# Altium project Gagabiro.PrjPcb
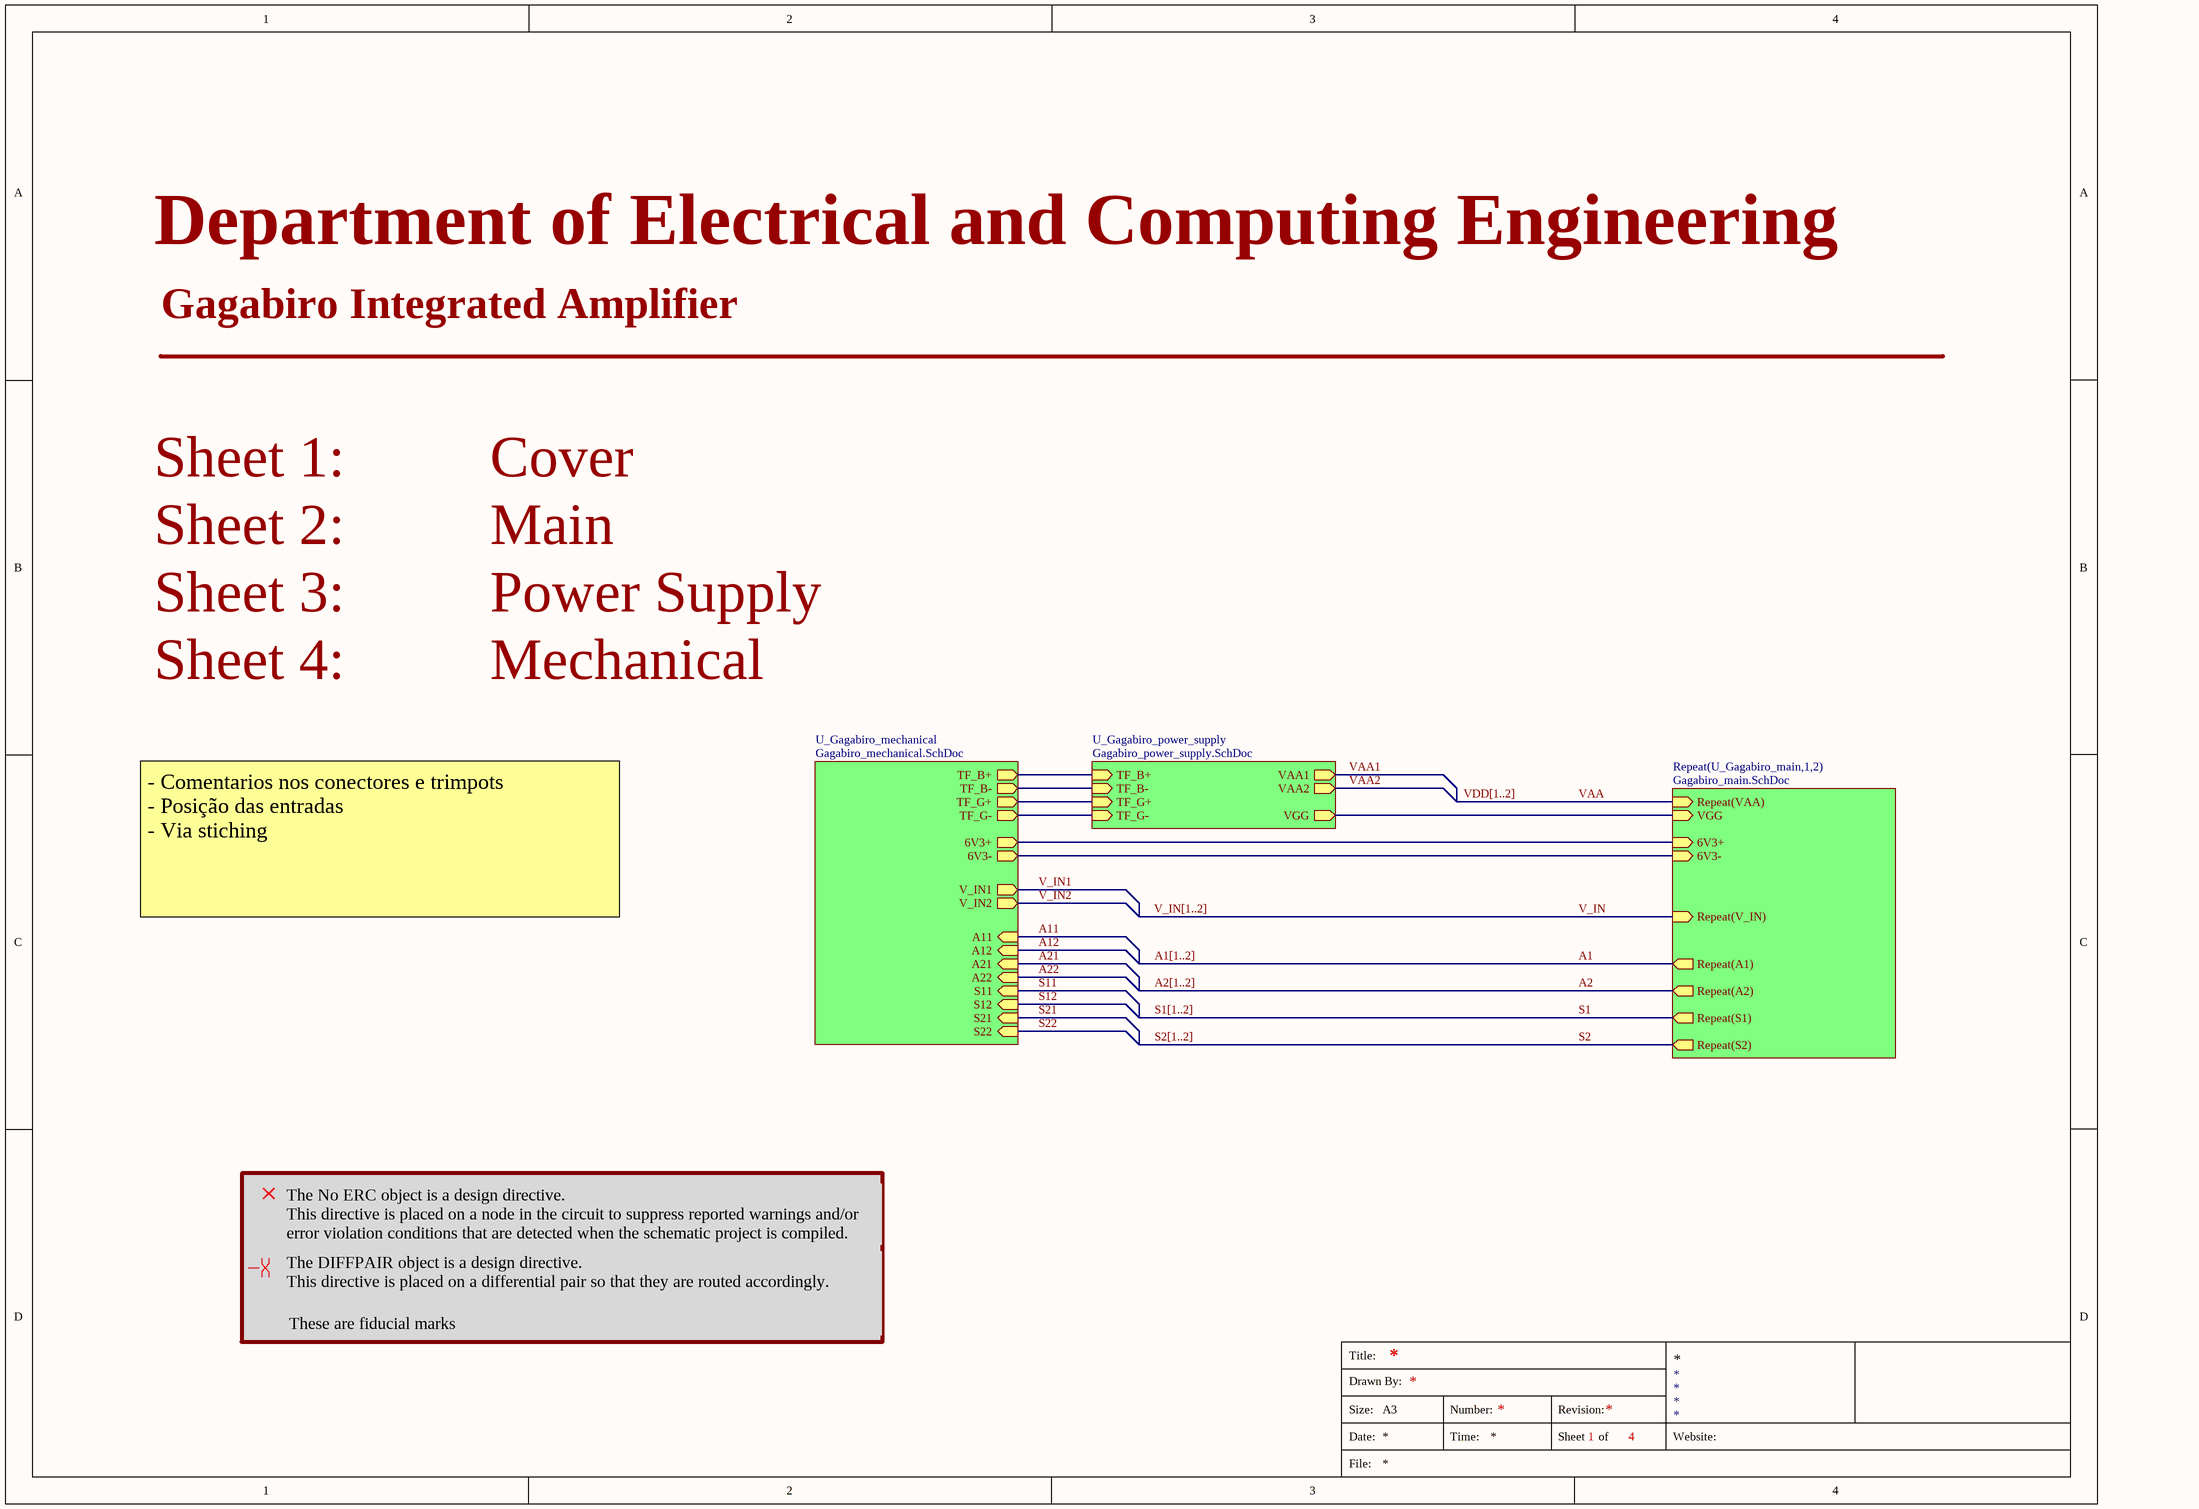
[diagram p0: Gagabiro_cover_letter.SchDoc]
4 sheets, 171 parts. Net scope: hierarchical (ports join the sheet entries above them; power ports are global).
Board file: Gagabiro.PcbDoc
Sheets:
  Gagabiro_cover_letter.SchDoc
    U_Gagabiro_main1 = Gagabiro_main.SchDoc
    U_Gagabiro_main2 = Gagabiro_main.SchDoc
    U_Gagabiro_mechanical = Gagabiro_mechanical.SchDoc
    U_Gagabiro_power_supply = Gagabiro_power_supply.SchDoc

## Sheet Gagabiro_cover_letter.SchDoc
size 393 x 281 mm; SheetNumber: 1; SheetTotal: 4

### Sub-sheets
Repeat(U_Gagabiro_main,1,2) = Gagabiro_main.SchDoc: Repeat(VAA) (in), Repeat(V_IN) (in), 6V3+ (in), 6V3- (in), VGG (in), Repeat(A1) (out), Repeat(S1) (out), Repeat(A2) (out), Repeat(S2) (out)
U_Gagabiro_mechanical = Gagabiro_mechanical.SchDoc: 6V3+ (out), 6V3- (out), V_IN1 (out), V_IN2 (out), TF_B+ (out), TF_B- (out), A11 (in), S11 (in), A21 (in), S21 (in), A12 (in), S12 (in), A22 (in), S22 (in), TF_G+ (out), TF_G- (out)
U_Gagabiro_power_supply = Gagabiro_power_supply.SchDoc: TF_B+ (in), TF_B- (in), VAA1 (out), VAA2 (out), VGG (out), TF_G+ (in), TF_G- (in)

### Nets
VAA1: sheet U_Gagabiro_power_supply/VAA1, sheet U_Gagabiro_power_supply/VAA2  [also labelled VAA2]
VGG: sheet Repeat(U_Gagabiro_main,1,2)/VGG, sheet U_Gagabiro_power_supply/VGG
6V3+: sheet Repeat(U_Gagabiro_main,1,2)/6V3+, sheet U_Gagabiro_mechanical/6V3+
6V3-: sheet Repeat(U_Gagabiro_main,1,2)/6V3-, sheet U_Gagabiro_mechanical/6V3-
A1: sheet Repeat(U_Gagabiro_main,1,2)/Repeat(A1)
A2: sheet Repeat(U_Gagabiro_main,1,2)/Repeat(A2)
S1: sheet Repeat(U_Gagabiro_main,1,2)/Repeat(S1)
S2: sheet Repeat(U_Gagabiro_main,1,2)/Repeat(S2)
TF_B+: sheet U_Gagabiro_mechanical/TF_B+, sheet U_Gagabiro_power_supply/TF_B+
TF_B-: sheet U_Gagabiro_mechanical/TF_B-, sheet U_Gagabiro_power_supply/TF_B-
TF_G+: sheet U_Gagabiro_mechanical/TF_G+, sheet U_Gagabiro_power_supply/TF_G+
TF_G-: sheet U_Gagabiro_mechanical/TF_G-, sheet U_Gagabiro_power_supply/TF_G-
V_IN: sheet Repeat(U_Gagabiro_main,1,2)/Repeat(V_IN)
VAA: sheet Repeat(U_Gagabiro_main,1,2)/Repeat(VAA)

### Buses and harness runs
bus A1[1..2]
bus A2[1..2]
bus S1[1..2]
bus S2[1..2]
bus V_IN[1..2]
bus VDD[1..2]

### Layout directives
differential pair: (no net found under the mark)

### Notes on the sheet
- Department of Electrical and Computing Engineering
- Gagabiro Integrated Amplifier
- Sheet 1:          Cover
- Sheet 2:          Main
- Sheet 3:          Power Supply
- Sheet 4:          Mechanical
- - Comentarios nos conectores e trimpots
  - Posição das entradas
  - Via stiching
- The No ERC object is a design directive.
  This directive is placed on a node in the circuit to suppress reported warnings and/or error violation conditions that are detected when the schematic project is compiled.
- The DIFFPAIR object is a design directive.
  This directive is placed on a differential pair so that they are routed accordingly.
- These are fiducial marks
- Title:
- Drawn By:
- Size:
- Date:
- File:
- A3
- Number:
- Time:
- Revision:
- Sheet
- of
- Website:

## Sheet Gagabiro_main.SchDoc
size 393 x 281 mm; SheetNumber: 2; SheetTotal: 4
Used 2 times, as channels U_Gagabiro_main1, U_Gagabiro_main2. Parts and nets are listed once, with the designators drawn on the sheet.
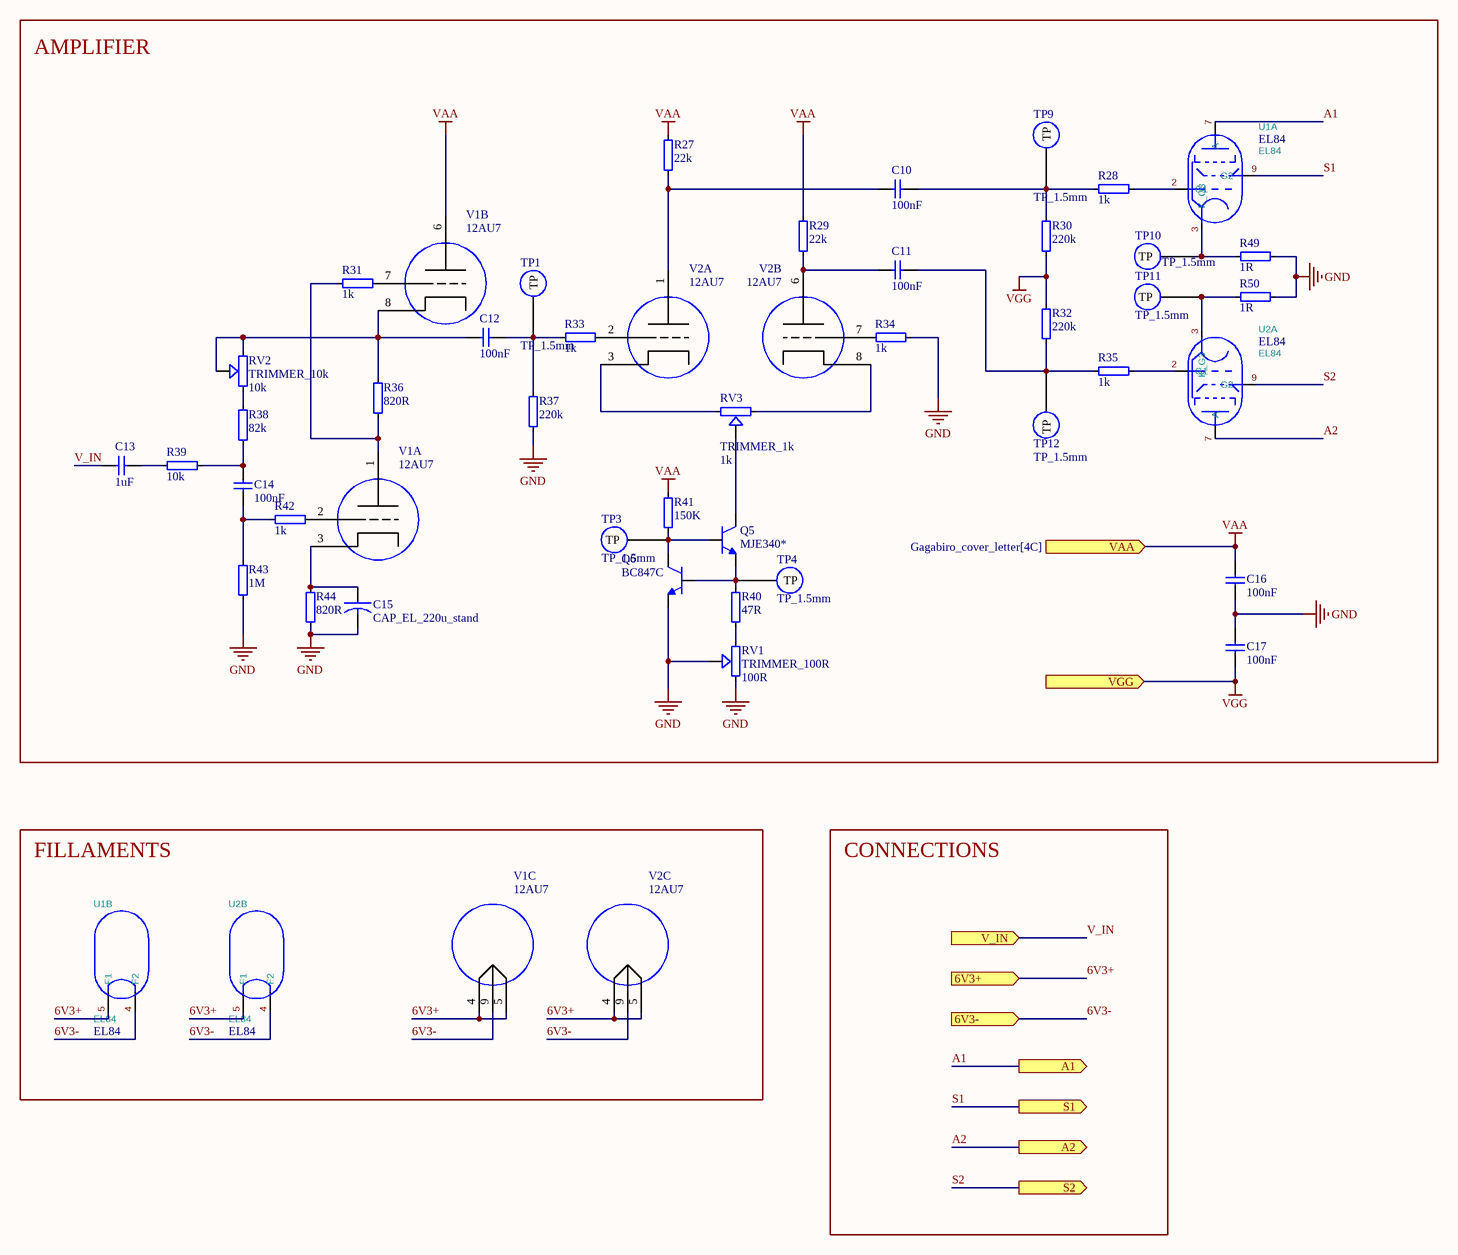
[diagram p1: Gagabiro_main.SchDoc]

### Parts
C10  100nF  [CAP_panassonic_100n_450V]
C11  100nF  [CAP_panassonic_100n_450V]
C12  100nF  [CAP_panassonic_100n_450V]
C13  1uF  [CAP_panassonic_1u_450V]
C14  100nF  [CAP_panassonic_100n_450V]
C15  CAP_EL_220u_stand  [CAPPRD500W50D630H1120_stand]
C16  100nF  [CAP_panassonic_100n_450V]
C17  100nF  [CAP_panassonic_100n_450V]
Q5  MJE340*  [TO126]
Q6  BC847C  [TRANS_BC847C]
R27  22k  [RES_2W_vertical]
R28  1k  [RES_2W_vertical]
R29  22k  [RES_2W_vertical]
R30  220k  [RES_2W_vertical]
R31  1k  [RES_2W_vertical]
R32  220k  [RES_2W_vertical]
R33  1k  [RES_2W_vertical]
R34  1k  [RES_2W_vertical]
R35  1k  [RES_2W_vertical]
R36  820R  [RES_2W_vertical]
R37  220k  [RES_2W_vertical]
R38  82k  [RES_2W_vertical]
R39  10k  [RES_2W_vertical]
R40  47R  [RES_2W_vertical]
R41  150K  [RES_2W_vertical]
R42  1k  [RES_2W_vertical]
R43  1M  [RES_2W_vertical]
R44  820R  [RES_2W_vertical]
R49  1R  [RES_2W_vertical]
R50  1R  [RES_2W_vertical]
RV1  TRIMMER_100R  value 100R  [TRIM_PV36W204C01B00 - duplicate]
RV2  TRIMMER_10k  value 10k  [TRIM_PV36W204C01B00 - duplicate]
RV3  TRIMMER_1k  value 1k  [TRIM_PV36W204C01B00 - duplicate]
TP1  TP_1.5mm  [test_point_1.5mm]
TP3  TP_1.5mm  [test_point_1.5mm]
TP4  TP_1.5mm  [test_point_1.5mm]
TP9  TP_1.5mm  [test_point_1.5mm]
TP10  TP_1.5mm  [test_point_1.5mm]
TP11  TP_1.5mm  [test_point_1.5mm]
TP12  TP_1.5mm  [test_point_1.5mm]
U1  EL84  [EL84]  (parts A,B of 2)
U2  EL84  [EL84]  (parts A,B of 2)
V1  12AU7  [12A_7]  (parts A,B,C of 3)
V2  12AU7  [12A_7]  (parts A,B,C of 3)

### Blocks framed on the sheet
AMPLIFIER: C10-C17 Q5 Q6 R27-R44 R49 R50 RV1-RV3 TP1 TP3 TP4 TP9-TP12 U1 U2 V1 V2
FILLAMENTS: U1 U2 V1 V2

### Ports
6V3+ (in, see Gagabiro_cover_letter[4C], Gagabiro_mechanical[2B]), 6V3- (in, see Gagabiro_cover_letter[4C], Gagabiro_mechanical[2B]), A1 (out, see Gagabiro_cover_letter[4C]), A2 (out, see Gagabiro_cover_letter[4C]), S1 (out, see Gagabiro_cover_letter[4C]), S2 (out, see Gagabiro_cover_letter[4C]), V_IN (in, see Gagabiro_cover_letter[4C]), VAA (in, see Gagabiro_cover_letter[4C]), VGG (in, see Gagabiro_cover_letter[4C], Gagabiro_power_supply[2D])

### Nets
GND: C15.N C16.1 C17.1 Q6.2(E) R34.2 R37.1 R43.1 R44.1 R49.2 R50.2 RV1.1 RV1.2
VAA: C16.2 R27.2 R29.2 R41.2 V1.6 ; port VAA
VGG: C17.2 R30.1 R32.1 ; port VGG
6V3+: U1.5(F1) U2.5(F1) V1.4 V1.5 V2.4 V2.5 ; port 6V3+
6V3-: U1.4(F2) U2.4(F2) V1.9 V2.9 ; port 6V3-
A1: U1.7(A) ; port A1
A2: U2.7(A) ; port A2
S1: U1.9(G2) ; port S1
S2: U2.9(G2) ; port S2
V_IN: C13.1 ; port V_IN
NetC10_1: C10.1 R27.1 V2.1
NetC10_2: C10.2 R28.1 R30.2 TP9.1(TP)
NetC11_1: C11.1 R29.1 V2.6
NetC11_2: C11.2 R32.2 R35.1 TP12.1(TP)
NetC12_1: C12.1 R36.2 RV2.2 RV2.3 V1.8
NetC12_2: C12.2 R33.1 R37.2 TP1.1(TP)
NetC13_2: C13.2 R39.1
NetC14_1: C14.1 R42.1 R43.2
NetC14_2: C14.2 R38.1 R39.2
NetC15_P: C15.P R44.2 V1.3
NetQ5_1: Q5.1(E) Q6.1(B) R40.2 TP4.1(TP)
NetQ5_2: Q5.2(C) RV3.2
NetQ5_3: Q5.3(B) Q6.3(C) R41.1 TP3.1(TP)
NetR28_2: R28.2 U1.2(G1)
NetR31_1: R31.1 R36.1 V1.1
NetR31_2: R31.2 V1.7
NetR33_2: R33.2 V2.2
NetR34_1: R34.1 V2.7
NetR35_2: R35.2 U2.2(G1)
NetR38_2: R38.2 RV2.1
NetR40_1: R40.1 RV1.3
NetR42_2: R42.2 V1.2
NetR49_1: R49.1 TP10.1(TP) U1.3(K_G3)
NetR50_1: R50.1 TP11.1(TP) U2.3(K_G3)
NetRV3_1: RV3.1 V2.8
NetRV3_3: RV3.3 V2.3

### Channels
U_Gagabiro_main1: designators end in A; ports 6V3+=6V3+ 6V3-=6V3- A1=A1 A2=A2 S1=S1 S2=S2 V_IN=V_IN VAA=VAA1 VGG=VGG
U_Gagabiro_main2: designators end in B; ports 6V3+=6V3+ 6V3-=6V3- A1=A1 A2=A2 S1=S1 S2=S2 V_IN=V_IN VAA=VAA1 VGG=VGG

### Notes on the sheet
- CONNECTIONS
- Title:
- Drawn By:
- Size:
- Date:
- File:
- A3
- Number:
- Time:
- Revision:
- Sheet
- of
- Website:

### Library data of the parts
C10-C12 C14 C16 C17 = CAP_POLY_100n: Capacitor, Silver Mica; Part Number: CMICA_47PF; Value: 100nF
C13 = CAP_POLY_1u: Capacitor, Silver Mica; Part Number: CMICA_47PF; Value: 1uF
C15 = CAP_EL_220u_stand: 220F 16V Aluminum Electrolytic Capacitors Radial, Can 1000 Hrs @ 105C; MP: EEU-HD1C221B; Value: 220uF; MF: Panasonic; Availability: In Stock; Purchase-URL: https://pricing.snapeda.com/search/part/EEU-HD1C221B/?ref=eda; Package: RADIAL-2 Panasonic; Check_prices: https://www.snapeda.com/parts/EEU-HD1C221B/Panasonic/view-part/?ref=eda; SnapEDA_Link: https://www.snapeda.com/parts/EEU-HD1C221B/Panasonic/view-part/?ref=snap; Price: None
Q5 = MJE340*: Bipolar (BJT) Transistor NPN 300 V 500 mA - 20.8 W Through Hole SOT-32-3; MF: STMicroelectronics; MP: MJE340; SnapEDA_Link: https://www.snapeda.com/parts/MJE340/STMicroelectronics/view-part/?ref=snap; Package: TO-126-3 Motorola; Value: *; Check_prices: https://www.snapeda.com/parts/MJE340/STMicroelectronics/view-part/?ref=eda
Q6 = BC847C: Bipolar (BJT) Transistor NPN 45 V 100 mA 300MHz 250 mW Surface Mount SOT-23-3 (TO-236); MF: Diotec Semiconductor; Price: None; SnapEDA_Link: https://www.snapeda.com/parts/BC847C/Diotec/view-part/?ref=snap; Purchase-URL: https://pricing.snapeda.com/search/part/BC847C/?ref=eda; Availability: In Stock; MP: BC847C; Package: SOT-23-3 Diotec; Check_prices: https://www.snapeda.com/parts/BC847C/Diotec/view-part/?ref=eda; Value: *
R27 R29 = R_2W_vertical_22k: Resistor, 2W; Part Number: R2W; ComponentLink1URL: N.A.; ComponentLink1Description: Datasheet; ComponentLink2URL: N.A.; ComponentLink2Description: Supplier link; Author: colombari; Value: 22k
R28 R31 R33-R35 R42 = R_2W_vertical_1k: Resistor, 2W; Part Number: R2W; ComponentLink1URL: N.A.; ComponentLink1Description: Datasheet; ComponentLink2URL: N.A.; ComponentLink2Description: Supplier link; Author: colombari; Value: 1k
R30 R32 R37 = R_2W_vertical_220k: Resistor, 2W; Part Number: R2W; ComponentLink1URL: N.A.; ComponentLink1Description: Datasheet; ComponentLink2URL: N.A.; ComponentLink2Description: Supplier link; Author: colombari; Value: 220k
R36 R44 = R_2W_vertical_820R: Resistor, 2W; Part Number: R2W; ComponentLink1URL: N.A.; ComponentLink1Description: Datasheet; ComponentLink2URL: N.A.; ComponentLink2Description: Supplier link; Author: colombari; Value: 820R
R38 = R_2W_vertical_82k: Resistor, 2W; Part Number: R2W; ComponentLink1URL: N.A.; ComponentLink1Description: Datasheet; ComponentLink2URL: N.A.; ComponentLink2Description: Supplier link; Author: colombari; Value: 82k
R39 = R_2W_vertical_10k: Resistor, 2W; Part Number: R2W; ComponentLink1URL: N.A.; ComponentLink1Description: Datasheet; ComponentLink2URL: N.A.; ComponentLink2Description: Supplier link; Author: colombari; Value: 10k
R40 = R_2W_vertical_47R: Resistor, 2W; Part Number: R2W; ComponentLink1URL: N.A.; ComponentLink1Description: Datasheet; ComponentLink2URL: N.A.; ComponentLink2Description: Supplier link; Author: colombari; Value: 47R
R41 = R_2W_vertical_150K: Resistor, 2W; Part Number: R2W; ComponentLink1URL: N.A.; ComponentLink1Description: Datasheet; ComponentLink2URL: N.A.; ComponentLink2Description: Supplier link; Author: colombari; Value: 150K
R43 = R_2W_vertical_1M: Resistor, 2W; Part Number: R2W; ComponentLink1URL: N.A.; ComponentLink1Description: Datasheet; ComponentLink2URL: N.A.; ComponentLink2Description: Supplier link; Author: colombari; Value: 1M
R49 R50 = R_2W_vertical_1R: Resistor, 2W; Part Number: R2W; ComponentLink1URL: N.A.; ComponentLink1Description: Datasheet; ComponentLink2URL: N.A.; ComponentLink2Description: Supplier link; Author: colombari; Value: 1R
RV1 = TRIMMER_100R: TRIMMER; MF: Bourns Electronics; MP: PV36W204C01B00.; SnapEDA_Link: https://www.snapeda.com/parts/PV36W204C01B00./Bourns/view-part/?ref=snap; Package: None; Check_prices: https://www.snapeda.com/parts/PV36W204C01B00./Bourns/view-part/?ref=eda
RV2 = TRIMMER_10k: TRIMMER; MF: Bourns Electronics; MP: PV36W204C01B00.; SnapEDA_Link: https://www.snapeda.com/parts/PV36W204C01B00./Bourns/view-part/?ref=snap; Package: None; Check_prices: https://www.snapeda.com/parts/PV36W204C01B00./Bourns/view-part/?ref=eda
RV3 = TRIMMER_1k: TRIMMER; MF: Bourns Electronics; MP: PV36W204C01B00.; SnapEDA_Link: https://www.snapeda.com/parts/PV36W204C01B00./Bourns/view-part/?ref=snap; Package: None; Check_prices: https://www.snapeda.com/parts/PV36W204C01B00./Bourns/view-part/?ref=eda
V1 V2 = 12AU7: TUNGSOL 12AU7 NEW PRD PREAMP TB; MF: RCA; MP: 12AX7; SnapEDA_Link: https://www.snapeda.com/parts/12AX7/RCA/view-part/?ref=snap; Package: None; Check_prices: https://www.snapeda.com/parts/12AX7/RCA/view-part/?ref=eda; Value: *
U1 U2 = EL84: Footprint: Valve:Valve_Noval_P; Value: EL84

## Sheet Gagabiro_mechanical.SchDoc
size 393 x 281 mm; SheetNumber: 4; SheetTotal: 4
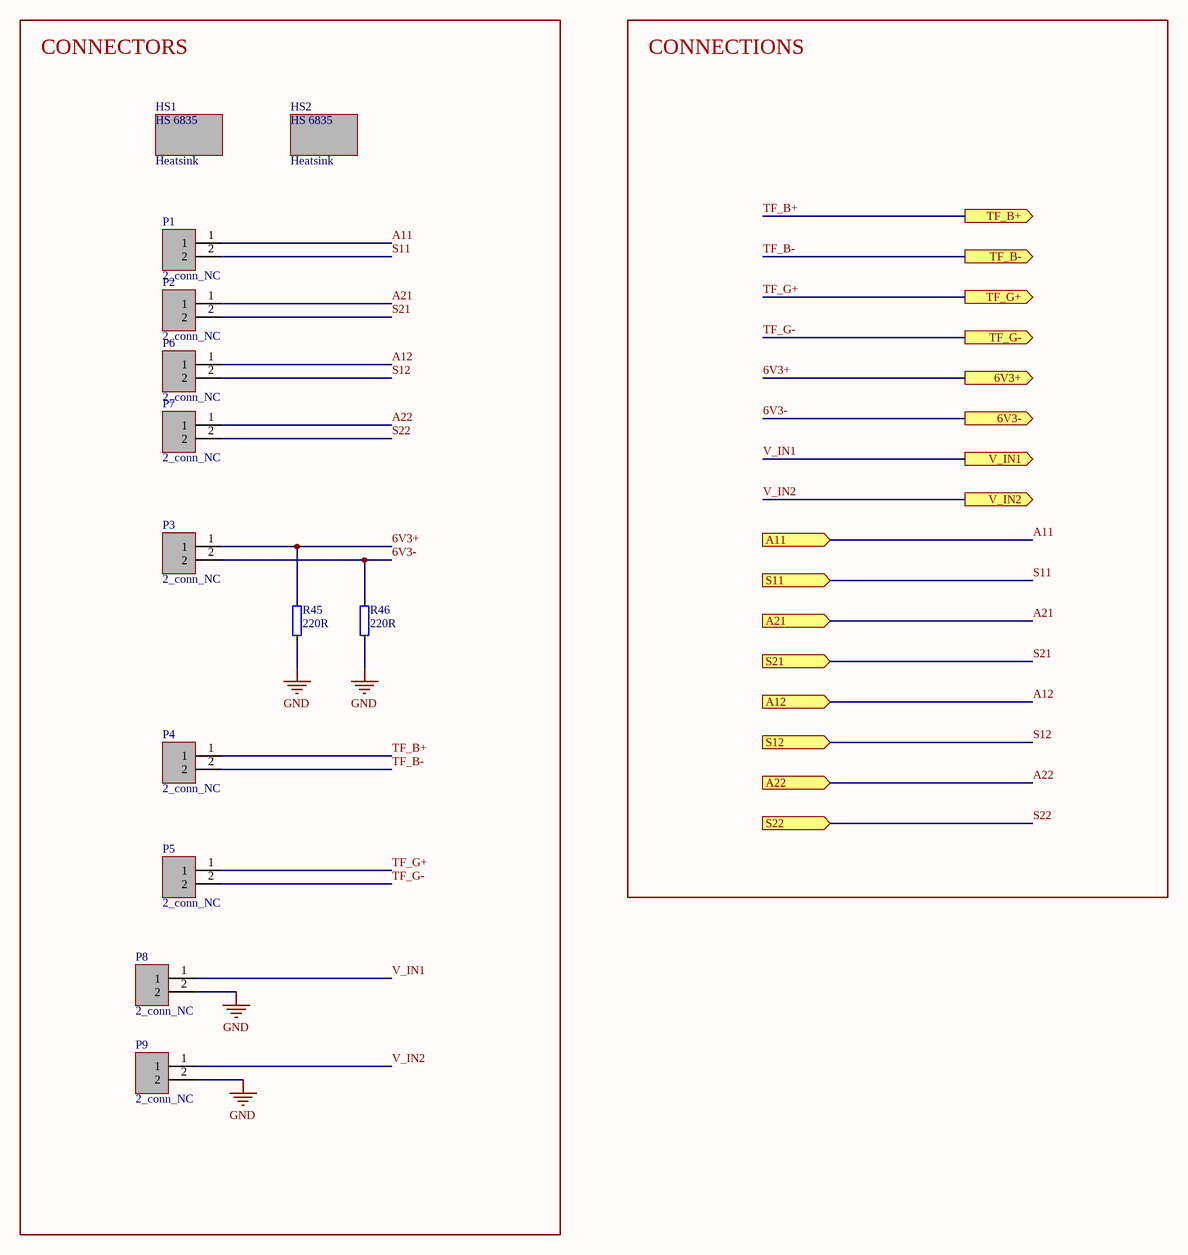
[diagram p2: Gagabiro_mechanical.SchDoc]

### Parts
HS1  Heatsink  [heatsink_HS_6835]
HS2  Heatsink  [heatsink_HS_6835]
P1  2_conn_NC  [2_conn_NC]
P2  2_conn_NC  [2_conn_NC]
P3  2_conn_NC  [2_conn_NC]
P4  2_conn_NC  [2_conn_NC]
P5  2_conn_NC  [2_conn_NC]
P6  2_conn_NC  [2_conn_NC]
P7  2_conn_NC  [2_conn_NC]
P8  2_conn_NC  [2_conn_NC]
P9  2_conn_NC  [2_conn_NC]
R45  220R  [RES_2W_vertical]
R46  220R  [RES_2W_vertical]

### Blocks framed on the sheet
CONNECTORS: HS1 HS2 P1-P9 R45 R46

### Ports
6V3+ (out, see Gagabiro_cover_letter[2C], Gagabiro_main[2C]), 6V3- (out, see Gagabiro_cover_letter[2C], Gagabiro_main[2C]), A11 (in, see Gagabiro_cover_letter[2C]), A12 (in, see Gagabiro_cover_letter[2C]), A21 (in, see Gagabiro_cover_letter[2C]), A22 (in, see Gagabiro_cover_letter[2C]), S11 (in, see Gagabiro_cover_letter[2C]), S12 (in, see Gagabiro_cover_letter[2C]), S21 (in, see Gagabiro_cover_letter[2C]), S22 (in, see Gagabiro_cover_letter[2C]), TF_B+ (out, see Gagabiro_cover_letter[2C], Gagabiro_power_supply[1D]), TF_B- (out, see Gagabiro_cover_letter[2C], Gagabiro_power_supply[1D]), TF_G+ (out, see Gagabiro_cover_letter[2C], Gagabiro_power_supply[1D]), TF_G- (out, see Gagabiro_cover_letter[2C], Gagabiro_power_supply[1D]), V_IN1 (out, see Gagabiro_cover_letter[2C]), V_IN2 (out, see Gagabiro_cover_letter[2C])

### Nets
GND: P8.2 P9.2 R45.1 R46.1
6V3+: P3.1 R45.2 ; port 6V3+
6V3-: P3.2 R46.2 ; port 6V3-
A11: P1.1 ; port A11  [project net A1]
A12: P6.1 ; port A12  [project net A1]
A21: P2.1 ; port A21  [project net A2]
A22: P7.1 ; port A22  [project net A2]
S11: P1.2 ; port S11  [project net S1]
S12: P6.2 ; port S12  [project net S1]
S21: P2.2 ; port S21  [project net S2]
S22: P7.2 ; port S22  [project net S2]
TF_B+: P4.1 ; port TF_B+
TF_B-: P4.2 ; port TF_B-
TF_G+: P5.1 ; port TF_G+
TF_G-: P5.2 ; port TF_G-
V_IN1: P8.1 ; port V_IN1  [project net V_IN]
V_IN2: P9.1 ; port V_IN2  [project net V_IN]

### Notes on the sheet
- CONNECTIONS
- Title:
- Drawn By:
- Size:
- Date:
- File:
- A3
- Number:
- Time:
- Revision:
- Sheet
- of
- Website:

### Library data of the parts
HS1 HS2 = HS 6835
P1-P9 = 2_conn_NC: Connector Header Surface Mount, Right Angle 2 position 0.079 (2.00mm); MP: S2B-PH-SM4-TB; MF: JST Sales; Price: None; Availability: In Stock; Package: None; Value: *; SnapEDA_Link: https://www.snapeda.com/parts/S2B-PH-SM4-TB/JST+Sales+America+Inc./view-part/?ref=snap; Purchase-URL: https://pricing.snapeda.com/search/part/S2B-PH-SM4-TB/?ref=eda; Check_prices: https://www.snapeda.com/parts/S2B-PH-SM4-TB/JST+Sales+America+Inc./view-part/?ref=eda
R45 R46 = R_2W_vertical_220R: Resistor, 2W; Part Number: R2W; ComponentLink1URL: N.A.; ComponentLink1Description: Datasheet; ComponentLink2URL: N.A.; ComponentLink2Description: Supplier link; Author: colombari; Value: 220R

## Sheet Gagabiro_power_supply.SchDoc
size 393 x 281 mm; SheetNumber: 3; SheetTotal: 4
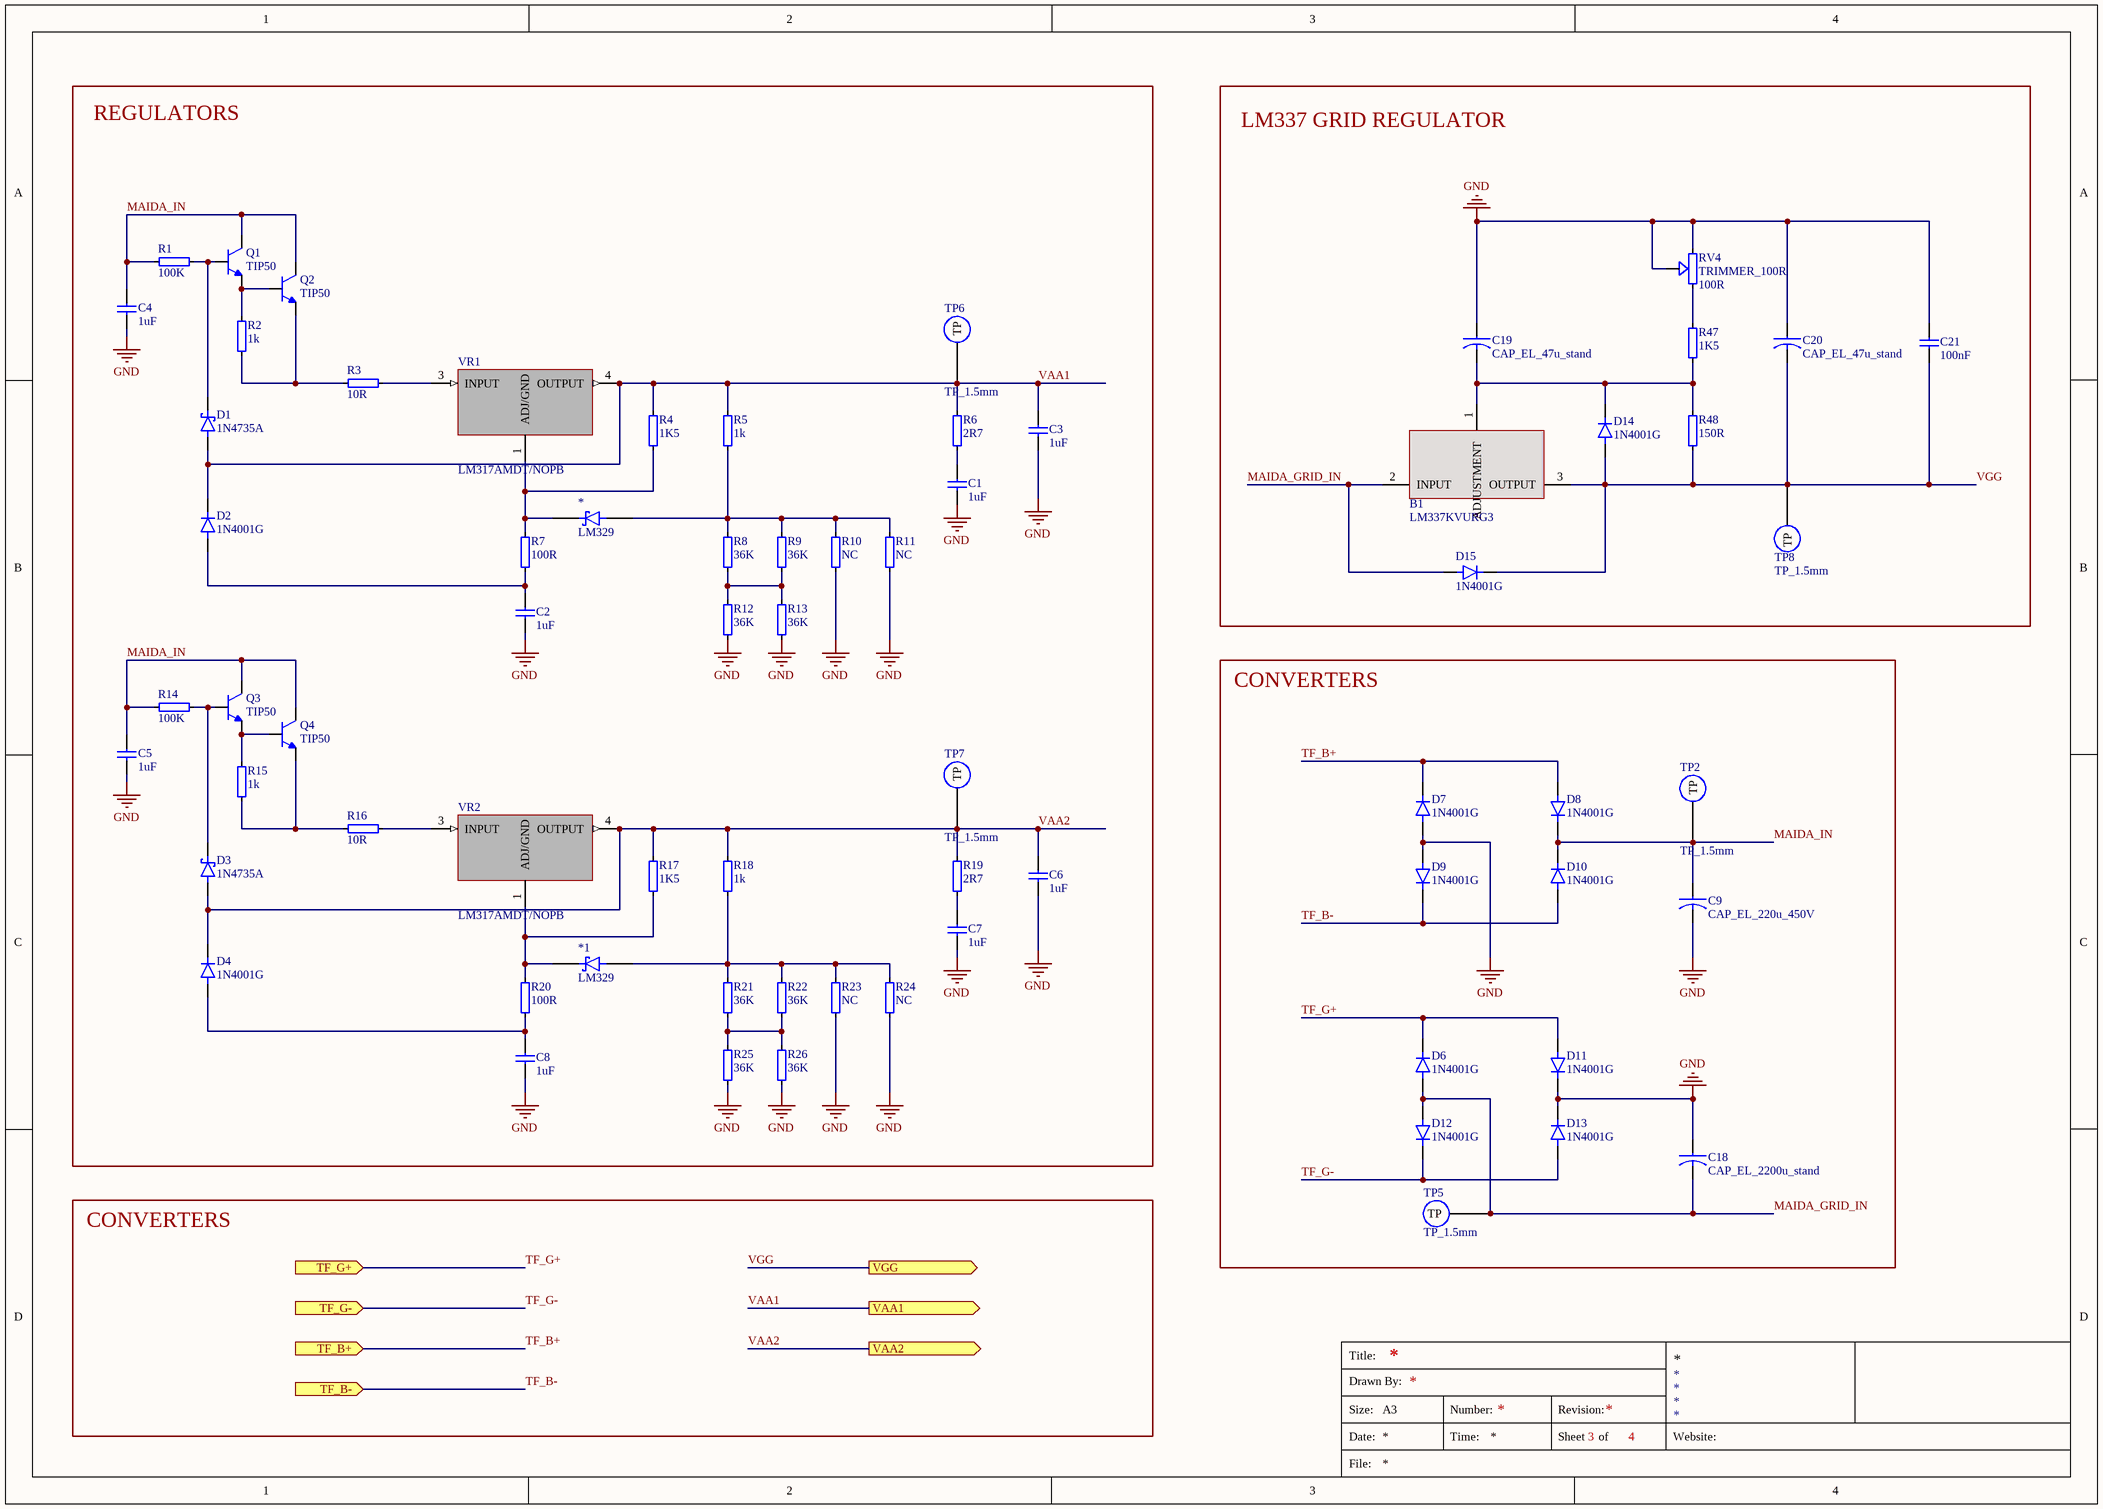
[diagram p3: Gagabiro_power_supply.SchDoc]

### Parts
*  LM329  [TO92127P495H495-3]
*1  LM329  [TO92127P495H495-3]
B1  LM337KVURG3  [LM337KVURG3]
C1  1uF  [CAP_panassonic_1u_450V]
C2  1uF  [CAP_panassonic_1u_450V]
C3  1uF  [CAP_panassonic_1u_450V]
C4  1uF  [CAP_panassonic_1u_450V]
C5  1uF  [CAP_panassonic_1u_450V]
C6  1uF  [CAP_panassonic_1u_450V]
C7  1uF  [CAP_panassonic_1u_450V]
C8  1uF  [CAP_panassonic_1u_450V]
C9  CAP_EL_220u_450V  [CAPPRD500W50D630H1120_stand_25x50]
C18  CAP_EL_2200u_stand  [CAPPRD500W50D630H1120_stand_22x40]
C19  CAP_EL_47u_stand  [CAPPRD500W50D630H1120_stand]
C20  CAP_EL_47u_stand  [CAPPRD500W50D630H1120_stand]
C21  100nF  [CAP_panassonic_100n_450V]
D1  1N4735A  [DIOAD1036W78L463D272]
D2  1N4001G  [DIOAD1036W78L470D235]
D3  1N4735A  [DIOAD1036W78L463D272]
D4  1N4001G  [DIOAD1036W78L470D235]
D6  1N4001G  [DIOAD1036W78L470D235]
D7  1N4001G  [DIOAD1036W78L470D235]
D8  1N4001G  [DIOAD1036W78L470D235]
D9  1N4001G  [DIOAD1036W78L470D235]
D10  1N4001G  [DIOAD1036W78L470D235]
D11  1N4001G  [DIOAD1036W78L470D235]
D12  1N4001G  [DIOAD1036W78L470D235]
D13  1N4001G  [DIOAD1036W78L470D235]
D14  1N4001G  [DIOAD1036W78L470D235]
D15  1N4001G  [DIOAD1036W78L470D235]
Q1  TIP50  [TO254P1009X445X1985-3]
Q2  TIP50  [TO254P1009X445X1985-3]
Q3  TIP50  [TO254P1009X445X1985-3]
Q4  TIP50  [TO254P1009X445X1985-3]
R1  100K  [RES_2W_vertical]
R2  1k  [RES_2W_vertical]
R3  10R  [RES_2W_vertical]
R4  1K5  [RES_2W_vertical]
R5  1k  [RES_2W_vertical]
R6  2R7  [RES_2W_vertical]
R7  100R  [RES_2W_vertical]
R8  36K  [RES_2W_vertical]
R9  36K  [RES_2W_vertical]
R10  NC  [RES_2W_vertical]
R11  NC  [RES_2W_vertical]
R12  36K  [RES_2W_vertical]
R13  36K  [RES_2W_vertical]
R14  100K  [RES_2W_vertical]
R15  1k  [RES_2W_vertical]
R16  10R  [RES_2W_vertical]
R17  1K5  [RES_2W_vertical]
R18  1k  [RES_2W_vertical]
R19  2R7  [RES_2W_vertical]
R20  100R  [RES_2W_vertical]
R21  36K  [RES_2W_vertical]
R22  36K  [RES_2W_vertical]
R23  NC  [RES_2W_vertical]
R24  NC  [RES_2W_vertical]
R25  36K  [RES_2W_vertical]
R26  36K  [RES_2W_vertical]
R47  1K5  [RES_2W_vertical]
R48  150R  [RES_2W_vertical]
RV4  TRIMMER_100R  value 100R  [TRIM_PV36W204C01B00 - duplicate]
TP2  TP_1.5mm  [test_point_1.5mm]
TP5  TP_1.5mm  [test_point_1.5mm]
TP6  TP_1.5mm  [test_point_1.5mm]
TP7  TP_1.5mm  [test_point_1.5mm]
TP8  TP_1.5mm  [test_point_1.5mm]
VR1  LM317AMDT/NOPB  [TO228P991X255-3N]
VR2  LM317AMDT/NOPB  [TO228P991X255-3N]

### Blocks framed on the sheet
REGULATORS: * *1 C1-C8 D1-D4 Q1-Q4 R1-R26 TP6 TP7 VR1 VR2
LM337 GRID REGULATOR: B1 C19-C21 D14 D15 R47 R48 RV4 TP8
CONVERTERS: C9 C18 D6-D13 TP2 TP5

### Ports
TF_B+ (in, see Gagabiro_cover_letter[3C], Gagabiro_mechanical[2A]), TF_B- (in, see Gagabiro_cover_letter[3C], Gagabiro_mechanical[2A]), TF_G+ (in, see Gagabiro_cover_letter[3C], Gagabiro_mechanical[2A]), TF_G- (in, see Gagabiro_cover_letter[3C], Gagabiro_mechanical[2B]), VAA1 (out, see Gagabiro_cover_letter[3C]), VAA2 (out, see Gagabiro_cover_letter[3C]), VGG (out, see Gagabiro_cover_letter[3C], Gagabiro_main[3B])

### Nets
GND: C1.1 C2.1 C3.1 C4.1 C5.1 C6.1 C7.1 C8.1 C9.N C18.P C19.P C20.P C21.2 D7.A D9.A D11.C(K) D13.C(K) R10.1 R11.1 R12.1 R13.1 R23.1 R24.1 R25.1 R26.1 RV4.2 RV4.3
VAA1: C3.2 C6.2 D1.2(A) D2.C(K) D3.2(A) D4.C(K) R4.2 R5.2 R6.2 R17.2 R18.2 R19.2 TP6.1(TP) TP7.1(TP) VR1.4(OUTPUT) VR2.4(OUTPUT) ; port VAA1, port VAA2  [also labelled VAA2]
VGG: B1.3(OUTPUT) C20.N C21.1 D14.A D15.C(K) R48.1 TP8.1(TP) ; port VGG
MAIDA_GRID_IN: B1.2(INPUT) C18.N D6.A D12.A D15.A TP5.1(TP)
MAIDA_IN: C4.2 C5.2 C9.P D8.C(K) D10.C(K) Q1.2(C) Q2.2(C) Q3.2(C) Q4.2(C) R1.1 R14.1 TP2.1(TP)
TF_B+: D7.C(K) D8.A ; port TF_B+
TF_B-: D9.C(K) D10.A ; port TF_B-
TF_G+: D6.C(K) D11.A ; port TF_G+
TF_G-: D12.C(K) D13.A ; port TF_G-
Net*1_2: *1.2 R17.1 R20.2 VR2.1(ADJ/GND)
Net*1_3: *1.3 R18.1 R21.2 R22.2 R23.2 R24.2
Net*_2: *.2 R4.1 R7.2 VR1.1(ADJ/GND)
Net*_3: *.3 R5.1 R8.2 R9.2 R10.2 R11.2
NetB1_1: B1.1(ADJUSTMENT) C19.N D14.C(K) R47.1 R48.2
NetC1_2: C1.2 R6.1
NetC2_2: C2.2 D2.A R7.1
NetC7_2: C7.2 R19.1
NetC8_2: C8.2 D4.A R20.1
NetD1_1: D1.1(K) Q1.1(B) R1.2
NetD3_1: D3.1(K) Q3.1(B) R14.2
NetQ1_3: Q1.3(E) Q2.1(B) R2.2
NetQ2_3: Q2.3(E) R2.1 R3.2
NetQ3_3: Q3.3(E) Q4.1(B) R15.2
NetQ4_3: Q4.3(E) R15.1 R16.2
NetR3_1: R3.1 VR1.3(INPUT)
NetR8_1: R8.1 R9.1 R12.2 R13.2
NetR16_1: R16.1 VR2.3(INPUT)
NetR21_1: R21.1 R22.1 R25.2 R26.2
NetR47_2: R47.2 RV4.1

### Notes on the sheet
- CONVERTERS
- Title:
- Drawn By:
- Size:
- Date:
- File:
- A3
- Number:
- Time:
- Revision:
- Sheet
- of
- Website:

### Library data of the parts
B1 = LM337KVURG3: 3 Pin 1.5A Adjustable Negative Voltage Regulator; Manufacturer_Name: Texas Instruments; Geometry.Height: 2.65mm; Mouser Part Number: 595-LM337KVURG3; Mouser Price/Stock: https://www.mouser.co.uk/ProductDetail/Texas-Instruments/LM337KVURG3?qs=iSMark9AYDXYOGB3Dr0rVg%3D%3D; Manufacturer_Part_Number: LM337KVURG3; Datasheet Link: http://www.ti.com/lit/gpn/lm337
C1-C8 = CAP_POLY_1u: as C13 on sheet Gagabiro_main; Value: 1uF
C9 = CAP_EL_220u_450V: 220F 16V Aluminum Electrolytic Capacitors Radial, Can 1000 Hrs @ 105C; MP: EEU-HD1C221B; Value: 220uF; MF: Panasonic; Availability: In Stock; Purchase-URL: https://pricing.snapeda.com/search/part/EEU-HD1C221B/?ref=eda; Package: RADIAL-2 Panasonic; Check_prices: https://www.snapeda.com/parts/EEU-HD1C221B/Panasonic/view-part/?ref=eda; SnapEDA_Link: https://www.snapeda.com/parts/EEU-HD1C221B/Panasonic/view-part/?ref=snap; Price: None
C18 = CAP_EL_2200u_stand: 220F 16V Aluminum Electrolytic Capacitors Radial, Can 1000 Hrs @ 105C; MP: EEU-HD1C221B; Value: 2200uF; MF: Panasonic; Availability: In Stock; Purchase-URL: https://pricing.snapeda.com/search/part/EEU-HD1C221B/?ref=eda; Package: RADIAL-2 Panasonic; Check_prices: https://www.snapeda.com/parts/EEU-HD1C221B/Panasonic/view-part/?ref=eda; SnapEDA_Link: https://www.snapeda.com/parts/EEU-HD1C221B/Panasonic/view-part/?ref=snap; Price: None
C19 C20 = CAP_EL_47u_stand: 220F 16V Aluminum Electrolytic Capacitors Radial, Can 1000 Hrs @ 105C; MP: EEU-HD1C221B; Value: 47uF; MF: Panasonic; Availability: In Stock; Purchase-URL: https://pricing.snapeda.com/search/part/EEU-HD1C221B/?ref=eda; Package: RADIAL-2 Panasonic; Check_prices: https://www.snapeda.com/parts/EEU-HD1C221B/Panasonic/view-part/?ref=eda; SnapEDA_Link: https://www.snapeda.com/parts/EEU-HD1C221B/Panasonic/view-part/?ref=snap; Price: None
C21 = CAP_POLY_100n: as C10 on sheet Gagabiro_main; Value: 100nF
D1 D3 = 1N4735A: Zener Diode 6.2V 1W Â±5% Through Hole DO-204AL (DO-41); MF: ON Semiconductor; SnapEDA_Link: https://www.snapeda.com/parts/1N4735A/Onsemi/view-part/?ref=snap; Package: DO-41 ON Semiconductor; Value: *; MP: 1N4735A; Check_prices: https://www.snapeda.com/parts/1N4735A/Onsemi/view-part/?ref=eda
D2 D4 D6-D15 = 1N4001G: 1A, 50V, Standard Recovery Rectifier; MF: Taiwan Semiconductor; Package: DO-41-2 Taiwan Semiconductor; Check_prices: https://www.snapeda.com/parts/1N4001G/Taiwan+Semiconductor/view-part/?ref=eda; Value: *; Price: None; MP: 1N4001G; Purchase-URL: https://pricing.snapeda.com/search/part/1N4001G/?ref=eda; SnapEDA_Link: https://www.snapeda.com/parts/1N4001G/Taiwan+Semiconductor/view-part/?ref=snap; Availability: In Stock
Q1-Q4 = TIP50: Bipolar (BJT) Transistor NPN 400 V 1 A 10MHz 2 W Through Hole TO-220-3; MF: ON Semiconductor; Price: None; SnapEDA_Link: https://www.snapeda.com/parts/TIP50/Onsemi/view-part/?ref=snap; Availability: In Stock; Value: *; MP: TIP50; Purchase-URL: https://pricing.snapeda.com/search/part/TIP50/?ref=eda; Package: TO-220-3 onsemi; Check_prices: https://www.snapeda.com/parts/TIP50/Onsemi/view-part/?ref=eda
R1 R14 = R_2W_vertical_100K: Resistor, 2W; Part Number: R2W; ComponentLink1URL: N.A.; ComponentLink1Description: Datasheet; ComponentLink2URL: N.A.; ComponentLink2Description: Supplier link; Author: colombari; Value: 100K
R2 R5 R15 R18 = R_2W_vertical_1k: Resistor, 2W; Part Number: R2W; ComponentLink1URL: N.A.; ComponentLink1Description: Datasheet; ComponentLink2URL: N.A.; ComponentLink2Description: Supplier link; Author: colombari; Value: 1k
R3 R16 = R_2W_vertical_10R: Resistor, 2W; Part Number: R2W; ComponentLink1URL: N.A.; ComponentLink1Description: Datasheet; ComponentLink2URL: N.A.; ComponentLink2Description: Supplier link; Author: colombari; Value: 10R
R4 R17 R47 = R_2W_vertical_1K5: Resistor, 2W; Part Number: R2W; ComponentLink1URL: N.A.; ComponentLink1Description: Datasheet; ComponentLink2URL: N.A.; ComponentLink2Description: Supplier link; Author: colombari; Value: 1K5
R6 R19 = R_2W_vertical_2R7: Resistor, 2W; Part Number: R2W; ComponentLink1URL: N.A.; ComponentLink1Description: Datasheet; ComponentLink2URL: N.A.; ComponentLink2Description: Supplier link; Author: colombari; Value: 2R7
R7 R20 = R_2W_vertical_100R: Resistor, 2W; Part Number: R2W; ComponentLink1URL: N.A.; ComponentLink1Description: Datasheet; ComponentLink2URL: N.A.; ComponentLink2Description: Supplier link; Author: colombari; Value: 100R
R8 R9 R12 R13 R21 R22 R25 R26 = R_2W_vertical_36K: Resistor, 2W; Part Number: R2W; ComponentLink1URL: N.A.; ComponentLink1Description: Datasheet; ComponentLink2URL: N.A.; ComponentLink2Description: Supplier link; Author: colombari; Value: 36K
R10 R11 R23 R24 = R_2W_vertical_NC: Resistor, 2W; Part Number: R2W; ComponentLink1URL: N.A.; ComponentLink1Description: Datasheet; ComponentLink2URL: N.A.; ComponentLink2Description: Supplier link; Author: colombari; Value: NC
R48 = R_2W_vertical_150R: Resistor, 2W; Part Number: R2W; ComponentLink1URL: N.A.; ComponentLink1Description: Datasheet; ComponentLink2URL: N.A.; ComponentLink2Description: Supplier link; Author: colombari; Value: 150R
RV4 = TRIMMER_100R: as RV1 on sheet Gagabiro_main; SnapEDA_Link: https://www.snapeda.com/parts/PV36W204C01B00./Bourns/view-part/?ref=snap; Package: None; Check_prices: https://www.snapeda.com/parts/PV36W204C01B00./Bourns/view-part/?ref=eda
VR1 VR2 = LM317AMDT/NOPB: Package: None; MP: LM317AMDT/NOPB; Price: None; Availability: Unavailable; Value: *

## Nets that join several sheets
GND: U_Gagabiro_main1 (12 pins), U_Gagabiro_main2 (12 pins), Gagabiro_mechanical (P8.2 P9.2 R45.1 R46.1), Gagabiro_power_supply (27 pins)
VAA1: U_Gagabiro_main1 (5 pins), U_Gagabiro_main2 (5 pins), Gagabiro_power_supply (16 pins)
VGG: U_Gagabiro_main1 (C17A.2 R30A.1 R32A.1), U_Gagabiro_main2 (C17B.2 R30B.1 R32B.1), Gagabiro_power_supply (7 pins)
6V3+: U_Gagabiro_main1 (6 pins), U_Gagabiro_main2 (6 pins), Gagabiro_mechanical (P3.1 R45.2)
6V3-: U_Gagabiro_main1 (U1A.4 U2A.4 V1A.9 V2A.9), U_Gagabiro_main2 (U1B.4 U2B.4 V1B.9 V2B.9), Gagabiro_mechanical (P3.2 R46.2)
A1: U_Gagabiro_main1 (U1A.7), Gagabiro_mechanical (P1.1)
A1: U_Gagabiro_main2 (U1B.7), Gagabiro_mechanical (P6.1)
A2: U_Gagabiro_main1 (U2A.7), Gagabiro_mechanical (P2.1)
A2: U_Gagabiro_main2 (U2B.7), Gagabiro_mechanical (P7.1)
S1: U_Gagabiro_main1 (U1A.9), Gagabiro_mechanical (P1.2)
S1: U_Gagabiro_main2 (U1B.9), Gagabiro_mechanical (P6.2)
S2: U_Gagabiro_main1 (U2A.9), Gagabiro_mechanical (P2.2)
S2: U_Gagabiro_main2 (U2B.9), Gagabiro_mechanical (P7.2)
TF_B+: Gagabiro_mechanical (P4.1), Gagabiro_power_supply (D7.C D8.A)
TF_B-: Gagabiro_mechanical (P4.2), Gagabiro_power_supply (D9.C D10.A)
TF_G+: Gagabiro_mechanical (P5.1), Gagabiro_power_supply (D6.C D11.A)
TF_G-: Gagabiro_mechanical (P5.2), Gagabiro_power_supply (D12.C D13.A)
V_IN: U_Gagabiro_main1 (C13A.1), Gagabiro_mechanical (P8.1)
V_IN: U_Gagabiro_main2 (C13B.1), Gagabiro_mechanical (P9.1)